# Altium schematic sheet Baja_PDU_004.SchDoc
size Tabloid
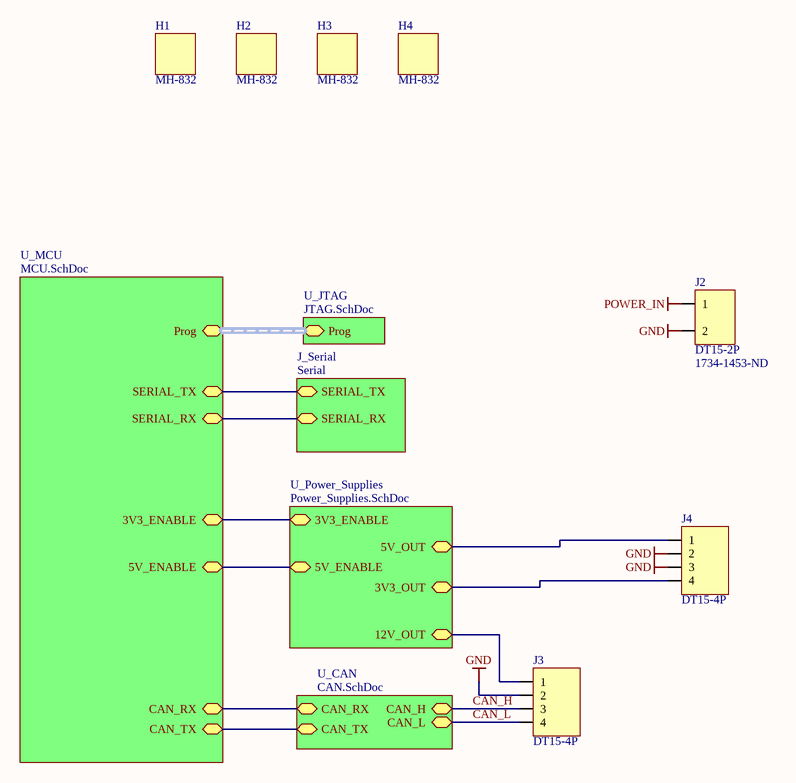
[diagram p0: Baja_PDU_004.SchDoc]

## Parts
H1  MH-832  [MH-832]
H2  MH-832  [MH-832]
H3  MH-832  [MH-832]
H4  MH-832  [MH-832]
J2  DT15-2P  Supplier Part Number 1: 1734-1453-ND  [Connector-DT15-2P]
J3  DT15-4P  [DT15-4P]
J4  DT15-4P  [DT15-4P]

## Sub-sheets
J_Serial = Serial: SERIAL_RX, SERIAL_TX
U_CAN = CAN.SchDoc: CAN_H (bidir), CAN_L (bidir), CAN_RX (bidir), CAN_TX (bidir)
U_JTAG = JTAG.SchDoc: Prog (harness Prog)
U_MCU = MCU.SchDoc: Prog (harness Prog), CAN_TX (bidir), CAN_RX (bidir), 5V_ENABLE (bidir), SERIAL_TX, SERIAL_RX, 3V3_ENABLE
U_Power_Supplies = Power_Supplies.SchDoc: 5V_ENABLE (bidir), 3V3_ENABLE, 3V3_OUT, 5V_OUT, 12V_OUT

## Nets
GND: J2.2 J3.2 J4.2 J4.3
POWER_IN: J2.1
CAN_H: J3.3 ; sheet U_CAN/CAN_H
CAN_L: J3.4 ; sheet U_CAN/CAN_L
NetJ3_1: J3.1 ; sheet U_Power_Supplies/12V_OUT
NetJ4_1: J4.1 ; sheet U_Power_Supplies/5V_OUT
NetJ4_4: J4.4 ; sheet U_Power_Supplies/3V3_OUT
(unnamed): sheet U_MCU/CAN_TX, sheet U_CAN/CAN_TX
(unnamed): sheet U_MCU/CAN_RX, sheet U_CAN/CAN_RX
(unnamed): sheet U_MCU/5V_ENABLE, sheet U_Power_Supplies/5V_ENABLE
(unnamed): sheet U_MCU/SERIAL_TX, sheet J_Serial/SERIAL_TX
(unnamed): sheet U_MCU/SERIAL_RX, sheet J_Serial/SERIAL_RX
(unnamed): sheet U_MCU/3V3_ENABLE, sheet U_Power_Supplies/3V3_ENABLE

## Buses and harness runs
harness sheet U_JTAG/Prog = sheet U_MCU/Prog

## Library data of the parts
J2 = Connector-DT15-2P: Supplier 1: Digi-Key
J3 J4 = Connector-DT15-4P: Supplier 1: Digi-Key; Supplier Part Number 1: 1734-1030-ND
H1-H4 = MH-832: Supplier Part Number 1: 91251A190